# Altium project HV_Board_Rev3.PrjPCB (part 2 of 2)

## Sheet Current_Monitoring.SchDoc
size A4
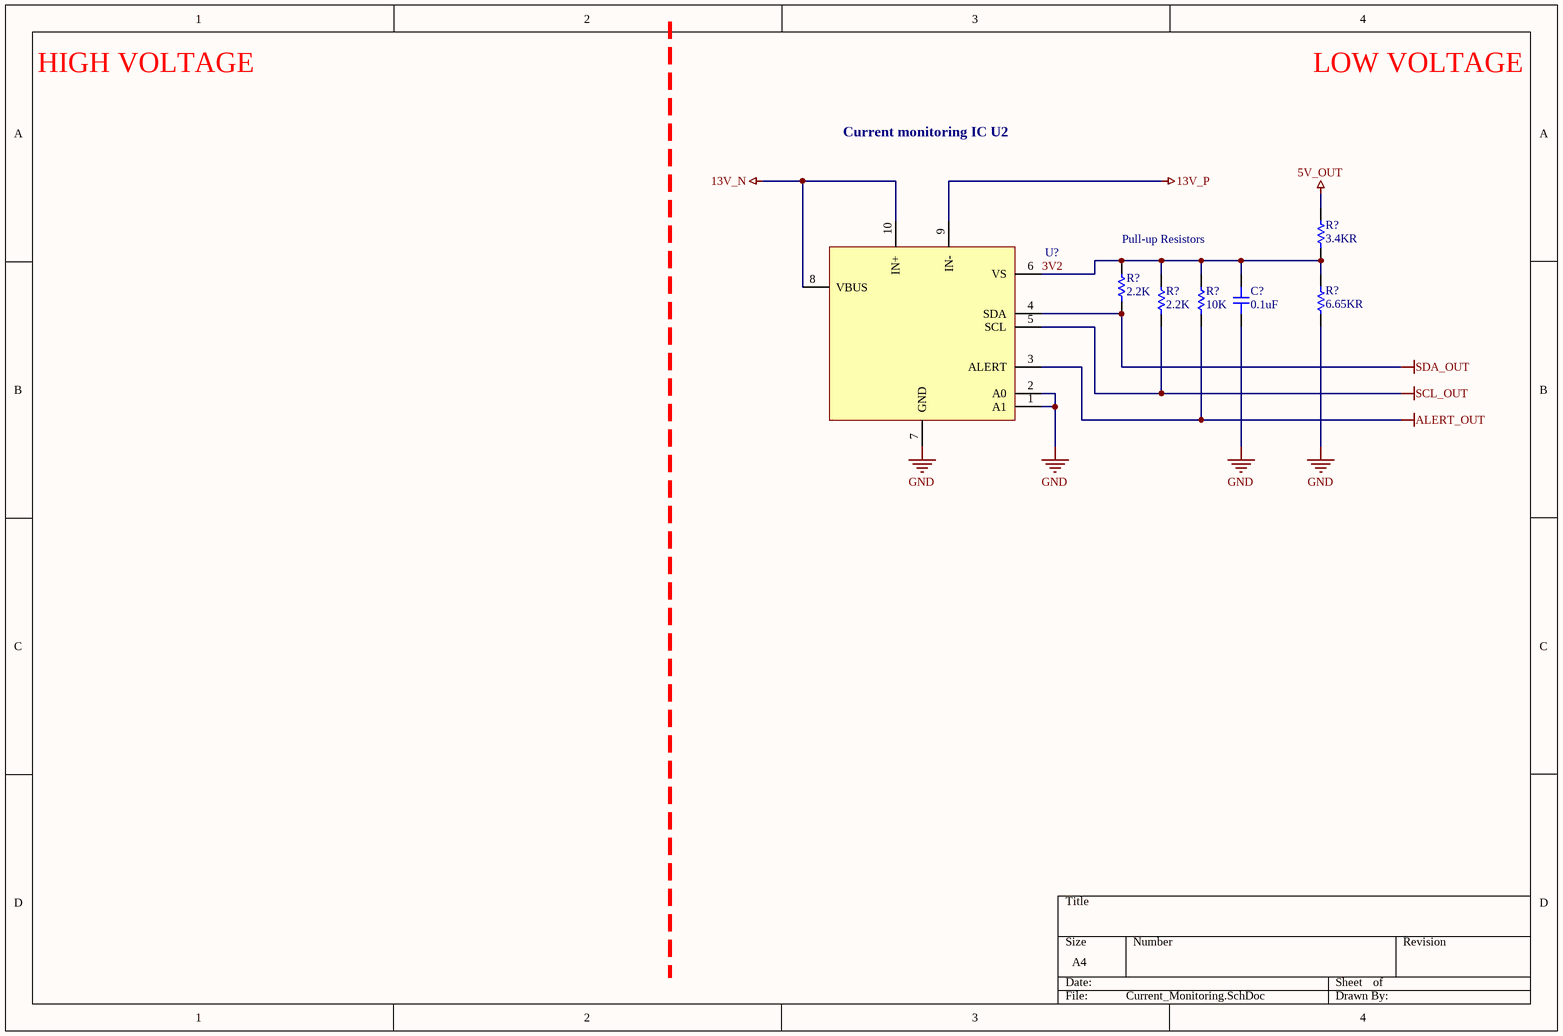
[diagram p5: Current_Monitoring.SchDoc]

### Parts
(Parts that share a designator on the sheet are numbered #1, #2 ... from top to bottom, then left to right.)
C?  0.1uF  [CAP-0805]
R?#4  3.4KR  [RES-0603]
R?#5  6.65KR  [RES-0603]
R?#6  2.2K  [RES-0603]
R?#7  2.2K  [RES-0603]
R?#8  10K  [RES-0603]
U?  INA226AIDGSR  [10-TFSOP, 10-MSOP INA226]  (value not drawn)

### Nets
5V_OUT: R?#4.2
13V_N: U?.8(VBUS) U?.10(IN+)
13V_P: U?.9(IN-)
ALERT_OUT: R?#8.1 U?.3(ALERT)
GND: C?.1 R?#5.2 U?.1(A1) U?.2(A0) U?.7(GND)
SCL_OUT: R?#7.1 U?.5(SCL)
SDA_OUT: R?#6.1 U?.4(SDA)
3V2: C?.2 R?#4.1 R?#5.1 R?#6.2 R?#7.2 R?#8.2 U?.6(VS)

### Notes on the sheet
- HIGH VOLTAGE
- LOW VOLTAGE
- Current monitoring IC U2
- (near R?#6) Pull-up Resistors

### Library data of the parts
C? = 0805-0.1uF-16V: CAP CER 0.1UF 16V Y5V 0805; Manufacturer: KEMET; Manufacturer Part Number: C0805C104Z4VACTU; Dielectric Material: Ceramic; Capacitance: 100nF; Tolerance: 80%; Supplier 1: Digi-Key; Stock 1: 18565; Pricing 1: 1=0.11, 10=0.081, 100=0.038, 500=0.02664, 1000=0.02205 (USD); Mount: Surface Mount; Case/Package: 0805; Case Code (Metric): 2012; Case Code (Imperial): 0805; Min Operating Temperature: -30°C; Max Operating Temperature: 85°C; Package Quantity: 1; Voltage Rating: 16V; Packaging: Tape and Reel; Voltage Rating (DC): 16V; Dielectric: Y5V; Termination: SMD/SMT; Length: 2mm; Height: 0.78mm; Width: 0.049inch; Thickness: 0.035inch; Lead Pitch: 0.75mm; Depth: 1.25mm; Lead Free: Lead Free; ComponentLink1URL: https://search.kemet.com/component-edge/download/datasheet/C0805C104Z4VACTU.pdf?src-supplier=Digi-Key; ComponentLink1Description: https://search.kemet.com/component-edge/download/datasheet/C0805C104Z4VACTU.pdf?src-supplier=Digi-Key; ComponentLink2URL: https://api.kemet.com/component-edge/download/datasheet/C0805C104Z4VACTU.pdf?src-supplier=Digi-Key; ComponentLink2Description: https://api.kemet.com/component-edge/download/datasheet/C0805C104Z4VACTU.pdf?src-supplier=Digi-Key; ComponentLink3URL: http://www.mouser.com/ds/2/212/KEM_C1005_Y5V_SMD-1101305.pdf?src-supplier=Mouser; ComponentLink3Description: http://www.mouser.com/ds/2/212/KEM_C1005_Y5V_SMD-1101305.pdf?src-supplier=Mouser; ComponentLink4URL: http://components.arrow.com/part/dataview/2091119S8993596N7429?src-supplier=Arrow; ComponentLink4Description: http://components.arrow.com/part/dataview/2091119S8993596N7429?src-supplier=Arrow; Supplier Part Number 1: 399-9159-6-ND
R?#4 = 0603-3.4KR: Res Thin Film 0603 3.4K Ohm 0.1% 1/10W ±25ppm/°C Molded SMD Paper T/R; Manufacturer: TE Connectivity; Manufacturer Part Number: RP73PF1J3K4BTDF; Power Rating: 166mW; Voltage Rating: 100V; Supplier 1: Digi-Key; Stock 1: 669; Pricing 1: 1=0.69, 10=0.494, 100=0.2568 (USD); Case/Package: 0603; Case Code (Metric): 1608; Case Code (Imperial): 0603; Min Operating Temperature: -55°C; Max Operating Temperature: 155°C; Resistance: 3.4kR; Tolerance: 0.1%; Termination: SMD/SMT; Packaging: Cut Tape; Resistor Type: Thin Film; Temperature Coefficient: 25ppm/°C; Voltage Rating (DC): 100V; Technology: THIN FILM; Series: RP73; Resistance Tolerance: 0.1%; Length: 1.55mm; Height: 0.45mm; Depth: 0.8mm; RoHS Compliant: Yes; REACH SVHC: No SVHC; ComponentLink1URL: http://www.farnell.com/datasheets/1635325.pdf?src-supplier=Element14; ComponentLink1Description: http://www.farnell.com/datasheets/1635325.pdf?src-supplier=Element14; Supplier Part Number 1: A110159DKR-ND
R?#5 = 0603-6.65KR: RES SMD 6.65K OHM 0.1% 1/6W 0603; Manufacturer: TE Connectivity; Manufacturer Part Number: 8-2176088-4; Power Rating: 166mW; Temperature Coefficient: 25ppm/°C; Voltage Rating: 100V; Max Power Dissipation: 167mW; Supplier 1: Digi-Key; Stock 1: 400; Pricing 1: 1=0.69, 10=0.494, 100=0.2568 (USD); Mount: Surface Mount; Case/Package: 0603; Case Code (Metric): 1608; Case Code (Imperial): 0603; Min Operating Temperature: -55°C; Max Operating Temperature: 155°C; Packaging: Tape and Reel; Resistance: 6.65kR; Tolerance: 0.1%; Resistor Type: Thin Film; Termination: Solder; Package Quantity: 1000; Number of Terminations: 2; Length: 0.061inch; Width: 0.031inch; Height: 0.022inch; ComponentLink1URL: http://www.te.com/commerce/DocumentDelivery/DDEController?Action=srchrtrv&DocNm=1773272&DocType=DS&DocLang=English&src-supplier=Digi-Key; ComponentLink1Description: http://www.te.com/commerce/DocumentDelivery/DDEController?Action=srchrtrv&DocNm=1773272&DocType=DS&DocLang=English&src-supplier=Digi-Key; Supplier Part Number 1: A110187DKR-ND
R?#6 R?#7 = 0603-2.2KR: RES SMD 2.2K OHM 1% 1/10W 0603; Manufacturer: Yageo Phycomp; Manufacturer Part Number: RC0603FR-072K2L; Power Rating: 100mW; Temperature Coefficient: 100ppm/°C; Resistance: 2.2kR; Voltage Rating (DC): 50V; Supplier 1: Digi-Key; Stock 1: 8205077; Pricing 1: 1=0.1, 10=0.023, 100=0.0094, 1000=0.00421, 2500=0.00366 (USD); Mount: Surface Mount; Case/Package: 0603; Number of Pins: 2; Min Operating Temperature: -55°C; Max Operating Temperature: 155°C; Tolerance: 1%; Packaging: Cut Tape; Length: 1.6mm; Height: 0.45mm; Depth: 0.8mm; Width: 800um; REACH SVHC: No SVHC; Lead Free: Lead Free; Supplier Part Number 1: 311-2.20KHRDKR-ND
R?#8 = 0603-10KR: RES SMD 10K OHM 5% 1/10W 0603; Manufacturer: Yageo; Manufacturer Part Number: RC0603JR-0710KL; Resistance: 10kR; Voltage Rating (DC): 50V; Temperature Coefficient: 100ppm/°C; Power Rating: 100mW; Supplier 1: Digi-Key; Stock 1: 3006558; Pricing 1: 1=0.1, 10=0.019, 100=0.0077, 1000=0.00347, 2500=0.00301 (USD); Case/Package: 0603; Number of Pins: 2; Contact Plating: Tin,Matte; Case Code (Imperial): 0603; Case Code (Metric): 1608; Min Operating Temperature: -55°C; Max Operating Temperature: 155°C; Packaging: Tape and Reel; Tolerance: 5%; Composition: Thick Film; Voltage Rating: 50V; Termination: SMD/SMT; Military Standard: Not; Features: Moisture Resistant; Max Power Dissipation: 100mW; Number of Terminations: 2; Length: 0.063inch; Width: 0.031inch; Depth: 0.8mm; Height - Seated (Max): 0.022inch; Radiation Hardening: No; REACH SVHC: Unknown; Lead Free: Lead Free; ComponentLink1URL: http://www.yageo.com/documents/recent/PYu-RC_Group_51_RoHS_L_10.pdf?src-supplier=Digi-Key; ComponentLink1Description: http://www.yageo.com/documents/recent/PYu-RC_Group_51_RoHS_L_10.pdf?src-supplier=Digi-Key; Supplier Part Number 1: 311-10KGRDKR-ND
U? = INA226AIDGSR: Bi Directional Current and Power Monitor 10-Pin VSSOP T/R; Manufacturer: Texas Instruments; Min Supply Voltage: 2.7V; Max Supply Voltage: 5.5V; Nominal Supply Current: 330uA; Common Mode Rejection Ratio: 140dB; Output Current: 10mA; Input Bias Current: 10uA; Input Offset Voltage (Vos): 2.5uV; Accuracy: 0.02%; Number of Amplifiers: 1; Bandwidth: 3.5kHz; Supplier 1: Digi-Key; Manufacturer Part Number: INA226AIDGSR; Stock 1: 55797; Pricing 1: 1=3.37, 10=3.027, 25=2.862, 100=2.3532, 250=2.11152, 500=2.0352, 1000=1.69176 (USD); Mount: Surface Mount; Case/Package: VSSOP; Number of Pins: 10; Contact Plating: Gold; Min Operating Temperature: -40°C; Max Operating Temperature: 125°C; Packaging: Tape and Reel; Package Quantity: 1; Series: -; Supply Current: 330uA; Radiation Hardening: No; REACH SVHC: No SVHC; Lead Free: Lead Free; RoHS Compliant: Yes; ComponentLink1URL: http://www.farnell.com/datasheets/1840205.pdf?src-supplier=Element14; ComponentLink1Description: http://www.farnell.com/datasheets/1840205.pdf?src-supplier=Element14; ComponentLink2URL: http://www.ti.com/lit/ds/symlink/ina226.pdf?src-supplier=Digi-Key; ComponentLink2Description: http://www.ti.com/lit/ds/symlink/ina226.pdf?src-supplier=Digi-Key; ComponentLink3URL: http://www.ti.com/lit/gpn/ina226?src-supplier=Mouser; ComponentLink3Description: http://www.ti.com/lit/gpn/ina226?src-supplier=Mouser; ComponentLink4URL: http://www.ti.com/general/docs/lit/getliterature.tsp?genericPartNumber=INA226&&fileType=pdf&src-supplier=Avnet; ComponentLink4Description: http://www.ti.com/general/docs/lit/getliterature.tsp?genericPartNumber=INA226&&fileType=pdf&src-supplier=Avnet; Supplier Part Number 1: 296-29034-1-ND

## Nets that join several sheets
+5V_HV: Connectors_and_Protection (D4.1 JP2.2), VoltageMeasurement (6 pins)
D+3.3V: Connectors_and_Protection (D3.16 JP1.2), VoltageMeasurement (8 pins), 3V3_PSU (C8.2 R6.2 U3.3)
D+12V: IMD (J9.7 R3.2), 3V3_PSU (C9#2.2 U3.1)
HV GND: HV_to_LV_Power_Supply (C5.2 C6.2 U1.1), Connectors_and_Protection (D4.2 D?.2 J2.1 JP2.1), VoltageMeasurement (8 pins), IMD (J7.1 J7.2)
LV GND: HV_to_LV_Power_Supply (8 pins), Connectors_and_Protection (20 pins), VoltageMeasurement (13 pins), IMD (6 pins), 3V3_PSU (C8.1 C9#2.1 D5.2 U3.2)
NetC2_2: HV_to_LV_Power_Supply (C2.2 C5.1 U1.2), Connectors_and_Protection (F1.2), IMD (J8.1 J8.2)
NetD2_15: Connectors_and_Protection (D2.15 D2.16 J1.2 J4.2), IMD (J9.1 R5.2)
NetD3_13: Connectors_and_Protection (D3.13 J5.6), VoltageMeasurement (U7.2)
NetD3_14: Connectors_and_Protection (D3.14 J5.7), VoltageMeasurement (U7.3)
NetD3_15: Connectors_and_Protection (D3.15 J5.8), VoltageMeasurement (U7.4)